# Altium schematic sheet 3V3 LDO Regulator.SchDoc: 3V3 LDO Regulator
size A4; DocumentNumber: 5; SheetNumber: 5; SheetTotal: 54
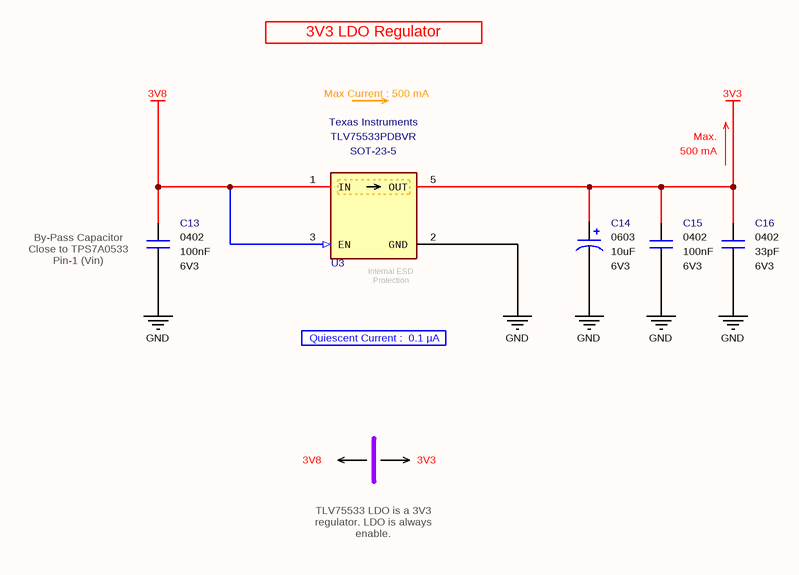
[diagram p0: 3V3 LDO Regulator.SchDoc]

## Parts
C13  value 100nF  Case: 0402  Voltage: 6V3  [CAPACITOR_0402]  (hidden comment: Multilayer Ceramic Capacitor)
C14  value 10uF  Case: 0603  Voltage: 6V3  [CAPACITOR_0603 - TANTALUM]  (hidden comment: Tantalum Capacitor)
C15  value 100nF  Case: 0402  Voltage: 6V3  [CAPACITOR_0402]  (hidden comment: Multilayer Ceramic Capacitor)
C16  value 33pF  Case: 0402  Voltage: 6V3  [CAPACITOR_0402]  (hidden comment: Multilayer Ceramic Capacitor)
U3  Manufacturer Part Number: TLV75533PDBVR  Manufacturer Name: Texas Instruments  [SOT-23-5]  (hidden comment: LDO Voltage Regulator)

## Nets
3V3: C14.1 C15.2 C16.1 U3.5(OUT)
3V8: C13.1 U3.1(IN) U3.3(EN)
GND: C13.2 C14.2 C15.1 C16.2 U3.2(GND)

Not connected (* = marked no-connect by the designer): U3 4(NC)

## Notes on the sheet
- 3V3 LDO Regulator
- Max Current : 500 mA
- Max.
- 500 mA
- (near C13) By-Pass Capacitor
  Close to TPS7A0533
  Pin-1 (Vin)
- Quiescent Current :  0.1 µA
- (near U3) Internal ESD Protection
- 3V8
- 3V3
- TLV75533 LDO is a 3V3 regulator. LDO is always enable.
- Title
- Size:
- Date:
- A4
- Number:
- Time:
- Revision:
- Sheet
- of
- File:

## Library data of the parts
C13 C15 = Capacitor - 100nF [0402-6V3]: Capacitor - 100nF [0402-6V3] (Ceramic); Manufacturer Name: AVX; Manufacturer Part Number: 04026D104KAT4A; Dielectric: X5R; Tolerance: %10; Height: 0.25mm; ComponentLink1Description: Mouser; ComponentLink1URL: https://www.mouser.com.tr/ProductDetail/AVX/04026D104KAT4A?qs=sGAEpiMZZMs0AnBnWHyRQPg4iYkCw7IMED%2F4kpqgf7w%3D; ComponentLink2Description: DataSheet; ComponentLink2URL: https://www.mouser.com.tr/datasheet/2/40/cx5r-776519.pdf; ROHS: Yes; Maximum Operating Temperature: +85; Minimum Operating Temperature: -55; Supplier 1: Avnet; Supplier Part Number 1: 04026D104KAT4A; Mouser Part Number: 581-04026D104KAT4A
C14 = Capacitor - 10uF [0603-6V3] (Tantalium): Capacitor - 10uF [0603] (Tantalium); Manufacturer Name: AVX; Manufacturer Part Number: F380J106MMAAH3; ESR: 200 mOhms; Leakage Current: 10uA; Tolerance: 20%; Height: 0.8mm; Maximum Operating Temperature: +105; Minimum Operating Temperature: -55; ROHS: Yes; ComponentLink1Description: DataSheet; ComponentLink1URL: https://www.mouser.com.tr/datasheet/2/40/f38-775706.pdf; ComponentLink2Description: Mouser; ComponentLink2URL: https://www.mouser.com.tr/ProductDetail/AVX/F380J106MMAAH3?qs=sGAEpiMZZMtZ1n0r9vR22fixilZl6Mr8zRKleESmvcDFwZ4LSyC6Pg%3D%3D; Supplier 1: Mouser; Supplier 2: Digi-Key; Supplier Part Number 2: 478-12031-1-ND; Supplier Part Number 1: 581-F380J106MMAAH3; Mouser Part Number: 581-F380J106MMAAH3
C16 = Capacitor - 33pF [0402-6V3]: Capacitor - 33pF [0402] (Ceramic); Manufacturer Name: Kemet; Manufacturer Part Number: C0402C330J9RACAUTO; Dielectric: X7R; Tolerance: 10%; Height: 0.5mm; Maximum Operating Temperature: +125; Minimum Operating Temperature: -55; ROHS: Yes; ComponentLink1Description: DataSheet; ComponentLink1URL: https://api.kemet.com/component-edge/download/datasheet/C0402C330J9RACAUTO.pdf; ComponentLink2Description: Mouser; ComponentLink2URL: https://www.mouser.com/Search/Refine.aspx?Keyword=80-C0402C330J9RAUTO; Supplier 1: Mouser; Supplier Part Number 1: 80-C0402C330J9RAUTO; Mouser Part Number: 80-C0402C330J9RAUTO
U3 = IC - TLV75533PDBVR: LDO Voltage Regulators 500-mA low-IQ small-size low-dropout (LDO) regulator.; Output Current: 500 mA; Output Voltage: 3.3 V; Dropout Voltage - Max: 220 mV at 500 mA; Height: 1.45mm; ComponentLink1Description: DataSheet; ComponentLink1URL: https://www.ti.com/lit/ds/symlink/tlv755p.pdf?HQS=dis-mous-null-mousermode-dsf-pf-null-wwe&DCM=yes&ref_url=https%3A%2F%2Fwww.mouser.de%2F&distId=26; ComponentLink2Description: Mouser; ComponentLink2URL: https://www.mouser.com.tr/ProductDetail/Texas-Instruments/TLV75533PDBVR/?qs=55YtniHzbhAKEwqeO2xJXQ%3D%3D; Minimum Operating Temperature: -40; Maximum Operating Temperature: +125; Supplier 1: Mouser; Supplier 2: Arrow Electronics; Supplier 3: Digi-Key; Supplier 4: Digi-Key; Supplier 5: Digi-Key; Supplier 6: Avnet; Supplier Part Number 1: 595-TLV75533PDBVR; Supplier Part Number 2: TLV75533PDBVR; Supplier Part Number 3: 296-50411-1-ND; Supplier Part Number 4: 296-50411-6-ND; Supplier Part Number 5: 296-50411-2-ND; Supplier Part Number 6: TLV75533PDBVR; Case: SOT-23-5; Mouser Part Number: 595-TLV75533PDBVR